# Altium project 11-LedDon.PrjPcb
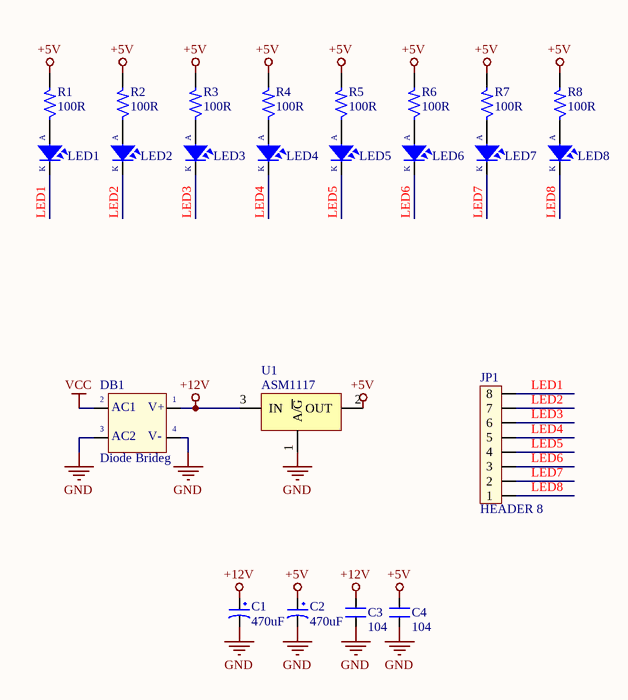
[diagram p0: 11-LedDon.SchDoc]
1 sheet, 23 parts. Net scope: global (net labels, ports and power ports of the same name join across sheets).
Board file: 11-LedDon.PcbDoc

## Sheet 11-LedDon.SchDoc
size A

### Parts
C1  470uF  [C-ALU-D6.5]
C2  470uF  [C-ALU-D6.5]
C3  104  [C-0805]
C4  104  [C-0805]
DB1  Diode Brideg  [D-DB-1A-SMD]
JP1  HEADER 8  [JP8-2.54]
LED1  LED  [LED-D3]  (value not drawn)
LED2  LED  [LED-D3]  (value not drawn)
LED3  LED  [LED-D3]  (value not drawn)
LED4  LED  [LED-D3]  (value not drawn)
LED5  LED  [LED-D3]  (value not drawn)
LED6  LED  [LED-D3]  (value not drawn)
LED7  LED  [LED-D3]  (value not drawn)
LED8  LED  [LED-D3]  (value not drawn)
R1  100R  [R-0805]
R2  100R  [R-0805]
R3  100R  [R-0805]
R4  100R  [R-0805]
R5  100R  [R-0805]
R6  100R  [R-0805]
R7  100R  [R-0805]
R8  100R  [R-0805]
U1  ASM1117  [TO-252]

### Nets
+5V: C2.1 C4.2 R1.2 R2.2 R3.2 R4.2 R5.2 R6.2 R7.2 R8.2 U1.2(OUT)
+12V: C1.1 C3.2 DB1.3(AC2) U1.3(IN)
GND: C1.2 C2.2 C3.1 C4.1 DB1.1(+V_OUT) DB1.4(-V_OUT) U1.1(A/~{G})
VCC: DB1.2(AC1)
LED1: JP1.8 LED1.2(K)
LED2: JP1.7 LED2.2(K)
LED3: JP1.6 LED3.2(K)
LED4: JP1.5 LED4.2(K)
LED5: JP1.4 LED5.2(K)
LED6: JP1.3 LED6.2(K)
LED7: JP1.2 LED7.2(K)
LED8: JP1.1 LED8.2(K)
NetLED1_1: LED1.1(A) R1.1
NetLED2_1: LED2.1(A) R2.1
NetLED3_1: LED3.1(A) R3.1
NetLED4_1: LED4.1(A) R4.1
NetLED5_1: LED5.1(A) R5.1
NetLED6_1: LED6.1(A) R6.1
NetLED7_1: LED7.1(A) R7.1
NetLED8_1: LED8.1(A) R8.1

### Notes on the sheet
- (in symbol DB) V+; V-

### Library data of the parts
C1 C2 = CP1: Cap P  0,1uF < 22uF , 16 - 50V; Value: 10uF/50V; Description 1: 10 => 220uF/6,3V/10V - 10uF => 100uF/16V; Description 2: 0,1uF => 33uF/50V - 10uF => 22uF/63V; Description 3: 0,47uF => 10uF/100V
C3 C4 = CN: Value: 0,1uF/300V; Designed by: VanDungEvn
DB1 = DB: Convert AC to DC voltage, 4 pin; Value: Cau 1A
JP1 = JP8: JP8 PIN; Value: JP7
LED1-LED8 = LED: LED Single colour Green and Red; Value: LED 3 ly Single Colour
R1-R8 = R: Resistor 1/4W; Value: R1/4W - 1K